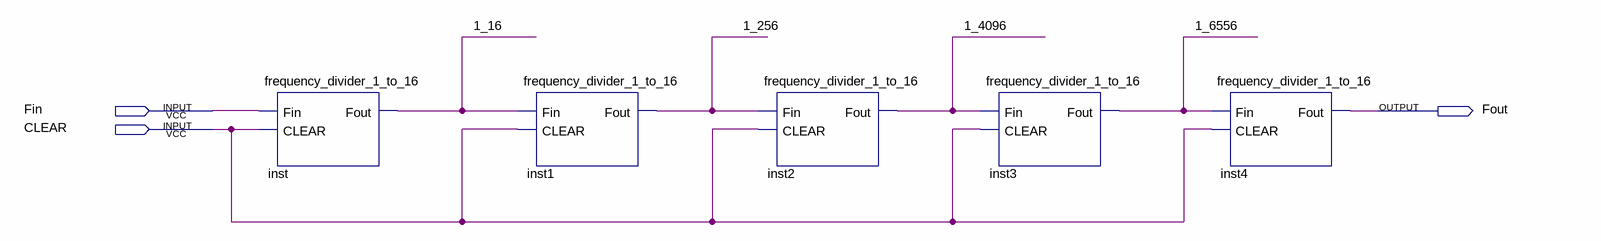
[diagram p0: schematic sheet]
// Quartus schematic frequency_divider_1_to_1048576.bdf as structural Verilog: 5 symbols, 3 pins
module frequency_divider_1_to_1048576 (
  input  Fin,
  input  CLEAR,
  output Fout
);

  wire \1_16 , \1_256 , \1_4096 , \1_6556 ;

  frequency_divider_1_to_16 inst (.Fin(Fin), .CLEAR(CLEAR), .Fout(\1_16 ));
  frequency_divider_1_to_16 inst1 (.Fin(\1_16 ), .CLEAR(CLEAR), .Fout(\1_256 ));
  frequency_divider_1_to_16 inst2 (.Fin(\1_256 ), .CLEAR(CLEAR), .Fout(\1_4096 ));
  frequency_divider_1_to_16 inst3 (.Fin(\1_4096 ), .CLEAR(CLEAR), .Fout(\1_6556 ));
  frequency_divider_1_to_16 inst4 (.Fin(\1_6556 ), .CLEAR(CLEAR), .Fout(Fout));
endmodule
